# Altium schematic sheet touch.SchDoc
size A4
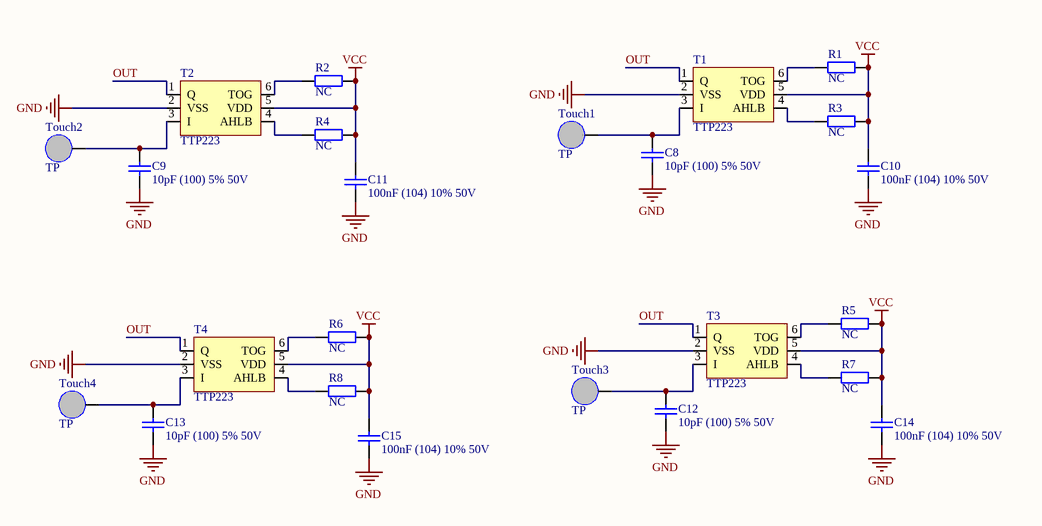
[diagram p0: touch.SchDoc]

## Parts
C8  10pF (100) 5% 50V  [0603_C]
C9  10pF (100) 5% 50V  [0603_C]
C10  100nF (104) 10% 50V  [0603_C]
C11  100nF (104) 10% 50V  [0603_C]
C12  10pF (100) 5% 50V  [0603_C]
C13  10pF (100) 5% 50V  [0603_C]
C14  100nF (104) 10% 50V  [0603_C]
C15  100nF (104) 10% 50V  [0603_C]
R1  NC  [0603_R]
R2  NC  [0603_R]
R3  NC  [0603_R]
R4  NC  [0603_R]
R5  NC  [0603_R]
R6  NC  [0603_R]
R7  NC  [0603_R]
R8  NC  [0603_R]
T1  TTP223  [SOT-23-6]
T2  TTP223  [SOT-23-6]
T3  TTP223  [SOT-23-6]
T4  TTP223  [SOT-23-6]
Touch1  TP  [TP]
Touch2  TP  [TP]
Touch3  TP  [TP]
Touch4  TP  [TP]

## Nets
GND: C8.1 C9.1 C10.1 C11.1 C12.1 C13.1 C14.1 C15.1 T1.2(VSS) T2.2(VSS) T3.2(VSS) T4.2(VSS)
VCC: C10.2 C11.2 C14.2 C15.2 R1.2 R2.2 R3.2 R4.2 R5.2 R6.2 R7.2 R8.2 T1.5(VDD) T2.5(VDD) T3.5(VDD) T4.5(VDD)
OUT: T1.1(Q) T2.1(Q) T3.1(Q) T4.1(Q)
NetC8_2: C8.2 T1.3(I) Touch1.1
NetC9_2: C9.2 T2.3(I) Touch2.1
NetC12_2: C12.2 T3.3(I) Touch3.1
NetC13_2: C13.2 T4.3(I) Touch4.1
NetR1_1: R1.1 T1.6(TOG)
NetR2_1: R2.1 T2.6(TOG)
NetR3_1: R3.1 T1.4(AHLB)
NetR4_1: R4.1 T2.4(AHLB)
NetR5_1: R5.1 T3.6(TOG)
NetR6_1: R6.1 T4.6(TOG)
NetR7_1: R7.1 T3.4(AHLB)
NetR8_1: R8.1 T4.4(AHLB)

## Library data of the parts
C8 C9 C12 C13 = 0603 10pF (100) 5% 50V: 贴片电容; ComponentLink1Description: 供应商链接; ComponentLink1URL: http://www.szlcsc.com/product/details_1986.html; Package: 0603; Supplier: LC; SuppliersPartNumber: C1634
C10 C11 C14 C15 = 0603 100nF (104) 10% 50V: 贴片电容; ComponentLink1Description: 供应商链接; ComponentLink1URL: http://www.szlcsc.com/product/details_15331.html; Package: 0603; Supplier: LC; SuppliersPartNumber: C14663
R1-R8 = 0603 10KΩ (1002) 1%: 贴片电阻; ComponentLink1Description: 供应商链接; ComponentLink1URL: http://www.szlcsc.com/product/details_26547.html; Package: 0603; Supplier: LC; SuppliersPartNumber: C25804